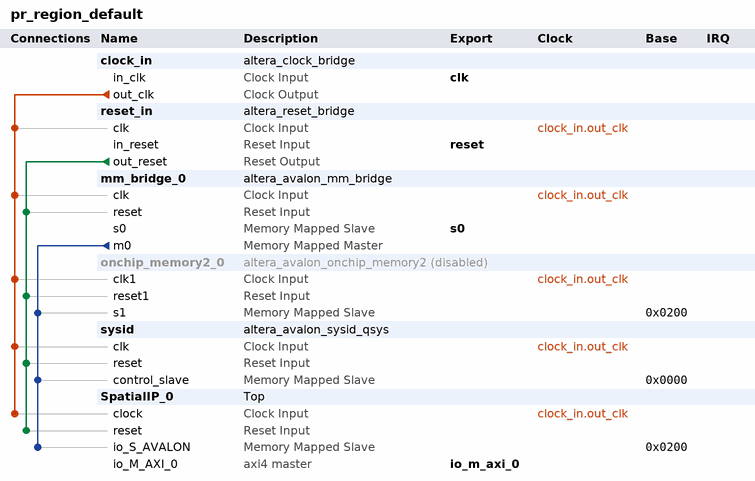
[diagram p0: system contents]
# Platform Designer (Qsys) system pr_region_default, Arria 10 10AS066N3F40E2SG
# Parameters at their usual value, and those the tool derives, are not listed.
package require -exact qsys 1.0
create_system pr_region_default
set_project_property DEVICE_FAMILY {Arria 10}
set_project_property DEVICE 10AS066N3F40E2SG

add_component clock_in ip/pr_region_default/pr_region_default_clock_in.ip altera_clock_bridge clock_in 17.1
load_component clock_in
set_component_parameter_value DERIVED_CLOCK_RATE 100000000
set_component_parameter_value EXPLICIT_CLOCK_RATE 50000000
save_component

add_component reset_in ip/pr_region_default/pr_region_default_reset_in.ip altera_reset_bridge reset_in 17.1
load_component reset_in
set_component_parameter_value ACTIVE_LOW_RESET 0
set_component_parameter_value SYNCHRONOUS_EDGES deassert
save_component

add_component mm_bridge_0 ip/pr_region_default/pr_region_default_mm_bridge_0.ip altera_avalon_mm_bridge mm_bridge_0 17.1

add_component onchip_memory2_0 ip/pr_region_default/pr_region_default_onchip_memory2_0.ip altera_avalon_onchip_memory2 onchip_memory2_0 17.1
load_component onchip_memory2_0
set_instance_property onchip_memory2_0 ENABLED false
set_component_parameter_value dataWidth 32
set_component_parameter_value dualPort false
set_component_parameter_value initMemContent false
set_component_parameter_value initializationFileName onchip_mem.hex
set_component_parameter_value memorySize 512
save_component

add_component sysid ip/pr_region_default/pr_region_default_sysid_qsys_0.ip altera_avalon_sysid_qsys sysid 17.1

add_component SpatialIP_0 ip/pr_region_default/pr_region_default_SpatialIP_0.ip Top SpatialIP_0 1.0

# connections
add_connection clock_in.out_clk mm_bridge_0.clk clock
add_connection clock_in.out_clk onchip_memory2_0.clk1 clock
add_connection clock_in.out_clk reset_in.clk clock
add_connection clock_in.out_clk SpatialIP_0.clock clock
add_connection clock_in.out_clk sysid.clk clock
add_connection reset_in.out_reset mm_bridge_0.reset reset
add_connection reset_in.out_reset onchip_memory2_0.reset1 reset
add_connection reset_in.out_reset SpatialIP_0.reset reset
add_connection reset_in.out_reset sysid.reset reset
add_connection mm_bridge_0.m0 onchip_memory2_0.s1 avalon
set_connection_parameter_value mm_bridge_0.m0/onchip_memory2_0.s1 baseAddress 0x0200
add_connection mm_bridge_0.m0 SpatialIP_0.io_S_AVALON avalon
set_connection_parameter_value mm_bridge_0.m0/SpatialIP_0.io_S_AVALON baseAddress 0x0200
add_connection mm_bridge_0.m0 sysid.control_slave avalon
set_connection_parameter_value mm_bridge_0.m0/sysid.control_slave baseAddress 0x0000

# exported interfaces
add_interface clk clock sink
set_interface_property clk EXPORT_OF clock_in.in_clk
add_interface io_m_axi_0 axi4 master
set_interface_property io_m_axi_0 EXPORT_OF SpatialIP_0.io_M_AXI_0
add_interface reset reset sink
set_interface_property reset EXPORT_OF reset_in.in_reset
add_interface s0 avalon slave
set_interface_property s0 EXPORT_OF mm_bridge_0.s0

set_interconnect_requirement {$system} qsys_mm.clockCrossingAdapter HANDSHAKE
set_interconnect_requirement {$system} qsys_mm.enableEccProtection FALSE
set_interconnect_requirement {$system} qsys_mm.insertDefaultSlave FALSE
set_interconnect_requirement {$system} qsys_mm.maxAdditionalLatency 1

save_system pr_region_default.qsys
